# Altium schematic sheet Sheet1.SchDoc
size A4
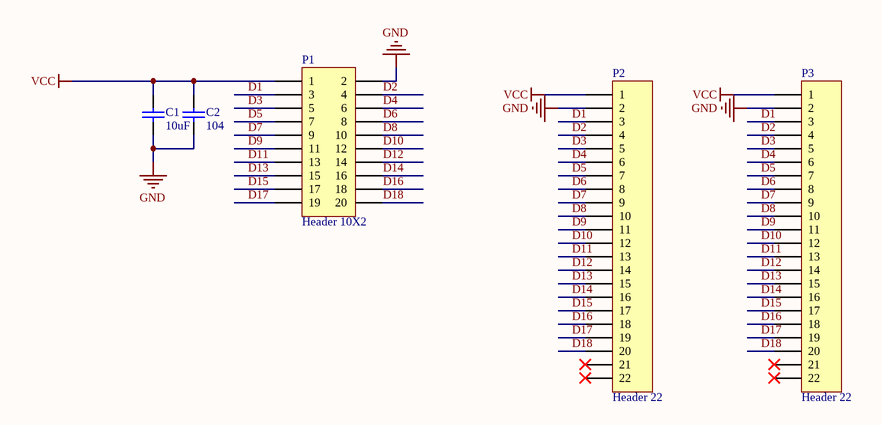
[diagram p0: Sheet1.SchDoc]

## Parts
C1  value 10uF  [C0805]  (hidden comment: Cap)
C2  value 104  [C0805]  (hidden comment: Cap)
P1  Header 10X2  [HDR2X10]
P2  Header 22  [FPC20Pin]
P3  Header 22  [FPC20Pin]

## Nets
GND: C1.1 C2.1 P1.2 P2.2 P3.2
VCC: C1.2 C2.2 P1.1 P2.1 P3.1
D1: P1.3 P2.3 P3.3
D2: P1.4 P2.4 P3.4
D3: P1.5 P2.5 P3.5
D4: P1.6 P2.6 P3.6
D5: P1.7 P2.7 P3.7
D6: P1.8 P2.8 P3.8
D7: P1.9 P2.9 P3.9
D8: P1.10 P2.10 P3.10
D9: P1.11 P2.11 P3.11
D10: P1.12 P2.12 P3.12
D11: P1.13 P2.13 P3.13
D12: P1.14 P2.14 P3.14
D13: P1.15 P2.15 P3.15
D14: P1.16 P2.16 P3.16
D15: P1.17 P2.17 P3.17
D16: P1.18 P2.18 P3.18
D17: P1.19 P2.19 P3.19
D18: P1.20 P2.20 P3.20

Not connected (* = marked no-connect by the designer): P2 21* 22*; P3 21* 22*

## Library data of the parts
C1 C2 = Cap: Capacitor; Published: 8-Jun-2000; LatestRevisionDate: 17-Jul-2002; LatestRevisionNote: Re-released for DXP Platform.; PackageReference: RAD-0.3; Publisher: Altium Limited; PackageDescription: Radial Cap, Thru-Hole; 2 Leads; 0.3 in Pin Spacing
P1 = Header 10X2: Header, 10-Pin, Dual row; LatestRevisionDate: 17-Jul-2002; LatestRevisionNote: Re-released for DXP Platform.; Publisher: Altium Limited
P2 P3 = Header 22: Header, 22-Pin; LatestRevisionDate: 17-Jul-2002; LatestRevisionNote: Re-released for DXP Platform.; Publisher: Altium Limited